# Altium schematic sheet AlarmIn.schdoc
size 216 x 191 mm
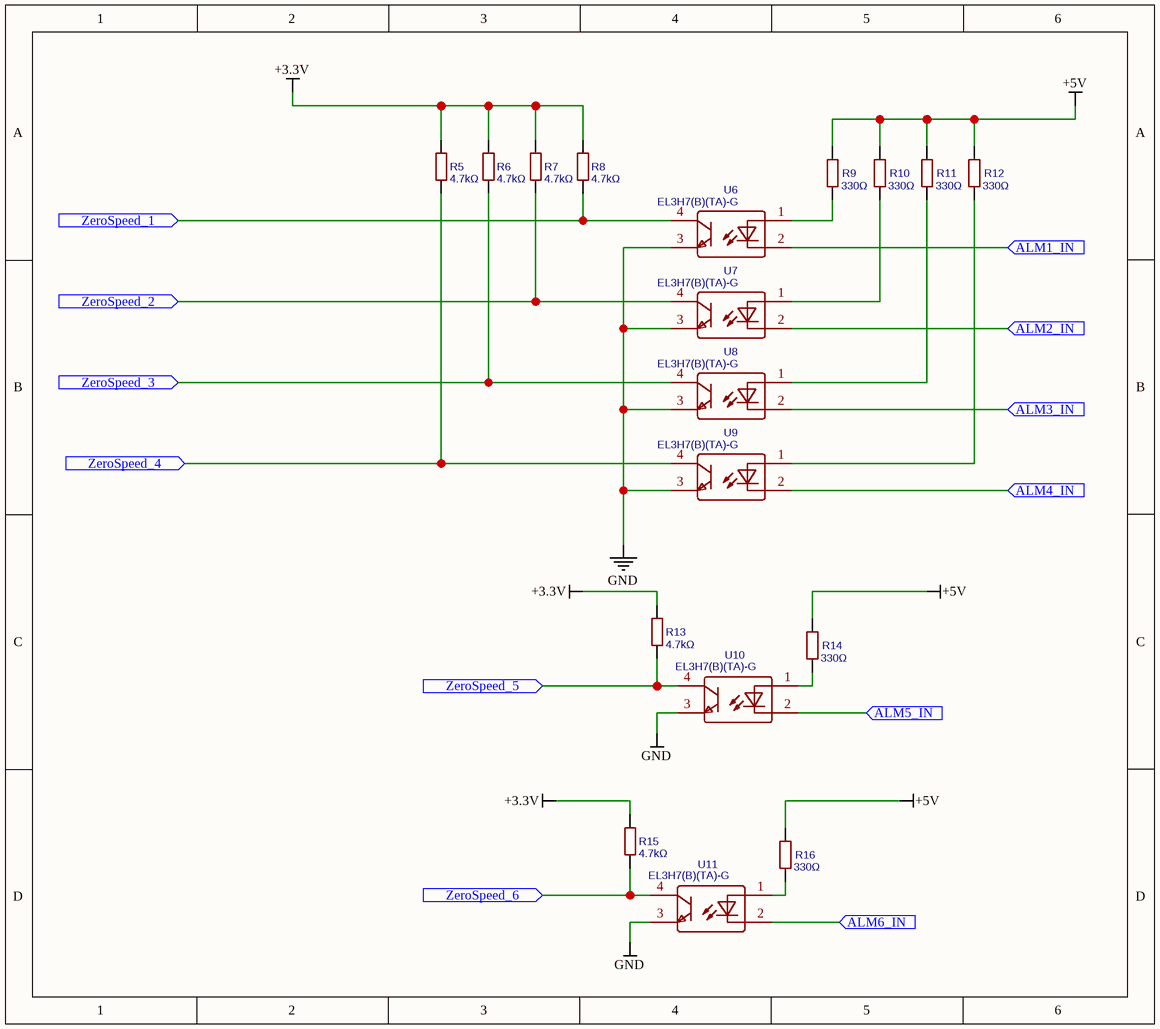
[diagram p0: AlarmIn.schdoc]

## Parts
R5  4.7kΩ  [R0805]
R6  4.7kΩ  [R0805]
R7  4.7kΩ  [R0805]
R8  4.7kΩ  [R0805]
R9  330Ω  [R0603]
R10  330Ω  [R0603]
R11  330Ω  [R0603]
R12  330Ω  [R0603]
R13  4.7kΩ  [R0805]
R14  330Ω  [R0603]
R15  4.7kΩ  [R0805]
R16  330Ω  [R0603]
U6  EL3H7(B)(TA)-G  [SOP-4_L4.4-W2.8-P1.27-LS7.0-TL]
U7  EL3H7(B)(TA)-G  [SOP-4_L4.4-W2.8-P1.27-LS7.0-TL]
U8  EL3H7(B)(TA)-G  [SOP-4_L4.4-W2.8-P1.27-LS7.0-TL]
U9  EL3H7(B)(TA)-G  [SOP-4_L4.4-W2.8-P1.27-LS7.0-TL]
U10  EL3H7(B)(TA)-G  [SOP-4_L4.4-W2.8-P1.27-LS7.0-TL]
U11  EL3H7(B)(TA)-G  [SOP-4_L4.4-W2.8-P1.27-LS7.0-TL]

## Ports
ALM1_IN (in), ALM2_IN (in), ALM3_IN (in), ALM4_IN (in), ALM5_IN (in), ALM6_IN (in), ZeroSpeed_1 (in), ZeroSpeed_2 (in), ZeroSpeed_3 (in), ZeroSpeed_4 (in), ZeroSpeed_5 (in), ZeroSpeed_6 (in)

## Nets
+3.3V: R5.2 R6.2 R7.2 R8.2 R13.2 R15.2
+5V: R9.2 R10.2 R11.2 R12.2 R14.2 R16.2
GND: U6.3(EM) U7.3(EM) U8.3(EM) U9.3(EM) U10.3(EM) U11.3(EM)
ALM1_IN: U6.2(CAT) ; port ALM1_IN
ALM2_IN: U7.2(CAT) ; port ALM2_IN
ALM3_IN: U8.2(CAT) ; port ALM3_IN
ALM4_IN: U9.2(CAT) ; port ALM4_IN
ALM5_IN: U10.2(CAT) ; port ALM5_IN
ALM6_IN: U11.2(CAT) ; port ALM6_IN
ZeroSpeed_1: R8.1 U6.4(COL) ; port ZeroSpeed_1
ZeroSpeed_2: R7.1 U7.4(COL) ; port ZeroSpeed_2
ZeroSpeed_3: R6.1 U8.4(COL) ; port ZeroSpeed_3
ZeroSpeed_4: R5.1 U9.4(COL) ; port ZeroSpeed_4
ZeroSpeed_5: R13.1 U10.4(COL) ; port ZeroSpeed_5
ZeroSpeed_6: R15.1 U11.4(COL) ; port ZeroSpeed_6
NetR9_1: R9.1 U6.1(AN)
NetR10_1: R10.1 U7.1(AN)
NetR11_1: R11.1 U8.1(AN)
NetR12_1: R12.1 U9.1(AN)
NetR14_1: R14.1 U10.1(AN)
NetR16_1: R16.1 U11.1(AN)

## Library data of the parts
R5-R8 R13 R15 = 4.7kΩ: Manufacturer: UniOhm; Manufacturer Part: 0805W8J0472T5E; nameAlias: Resistance; Resistance (Ohms): 4.7K; Supplier: LCSC; Supplier Part: C26022; JLCPCB Part Class: Extended Part; spicePre: R; spiceSymbolName: 0805W8J0472T5E
R9-R12 R14 R16 = 330Ω: Manufacturer: FH; Manufacturer Part: RS-03K331FT; Resistance (Ohms): 330; nameAlias: Resistance; Contributor: LCSC; Supplier: LCSC; Supplier Part: C125768; JLCPCB Part Class: Extended Part; spicePre: R; spiceSymbolName: RS-03K331FT
U6-U11 = EL3H7(B)(TA)-G: Manufacturer: EVERLIGHT(亿光); Supplier: LCSC; Manufacturer Part: EL3H7(B)(TA)-G; Supplier Part: C32565; JLCPCB Part Class: Basic Part; spicePre: U; spiceSymbolName: EL3H7(B)(TA)-G